# EAGLE design IO Shield_With_Power_Supply_PCB (EAGLE 6.4)
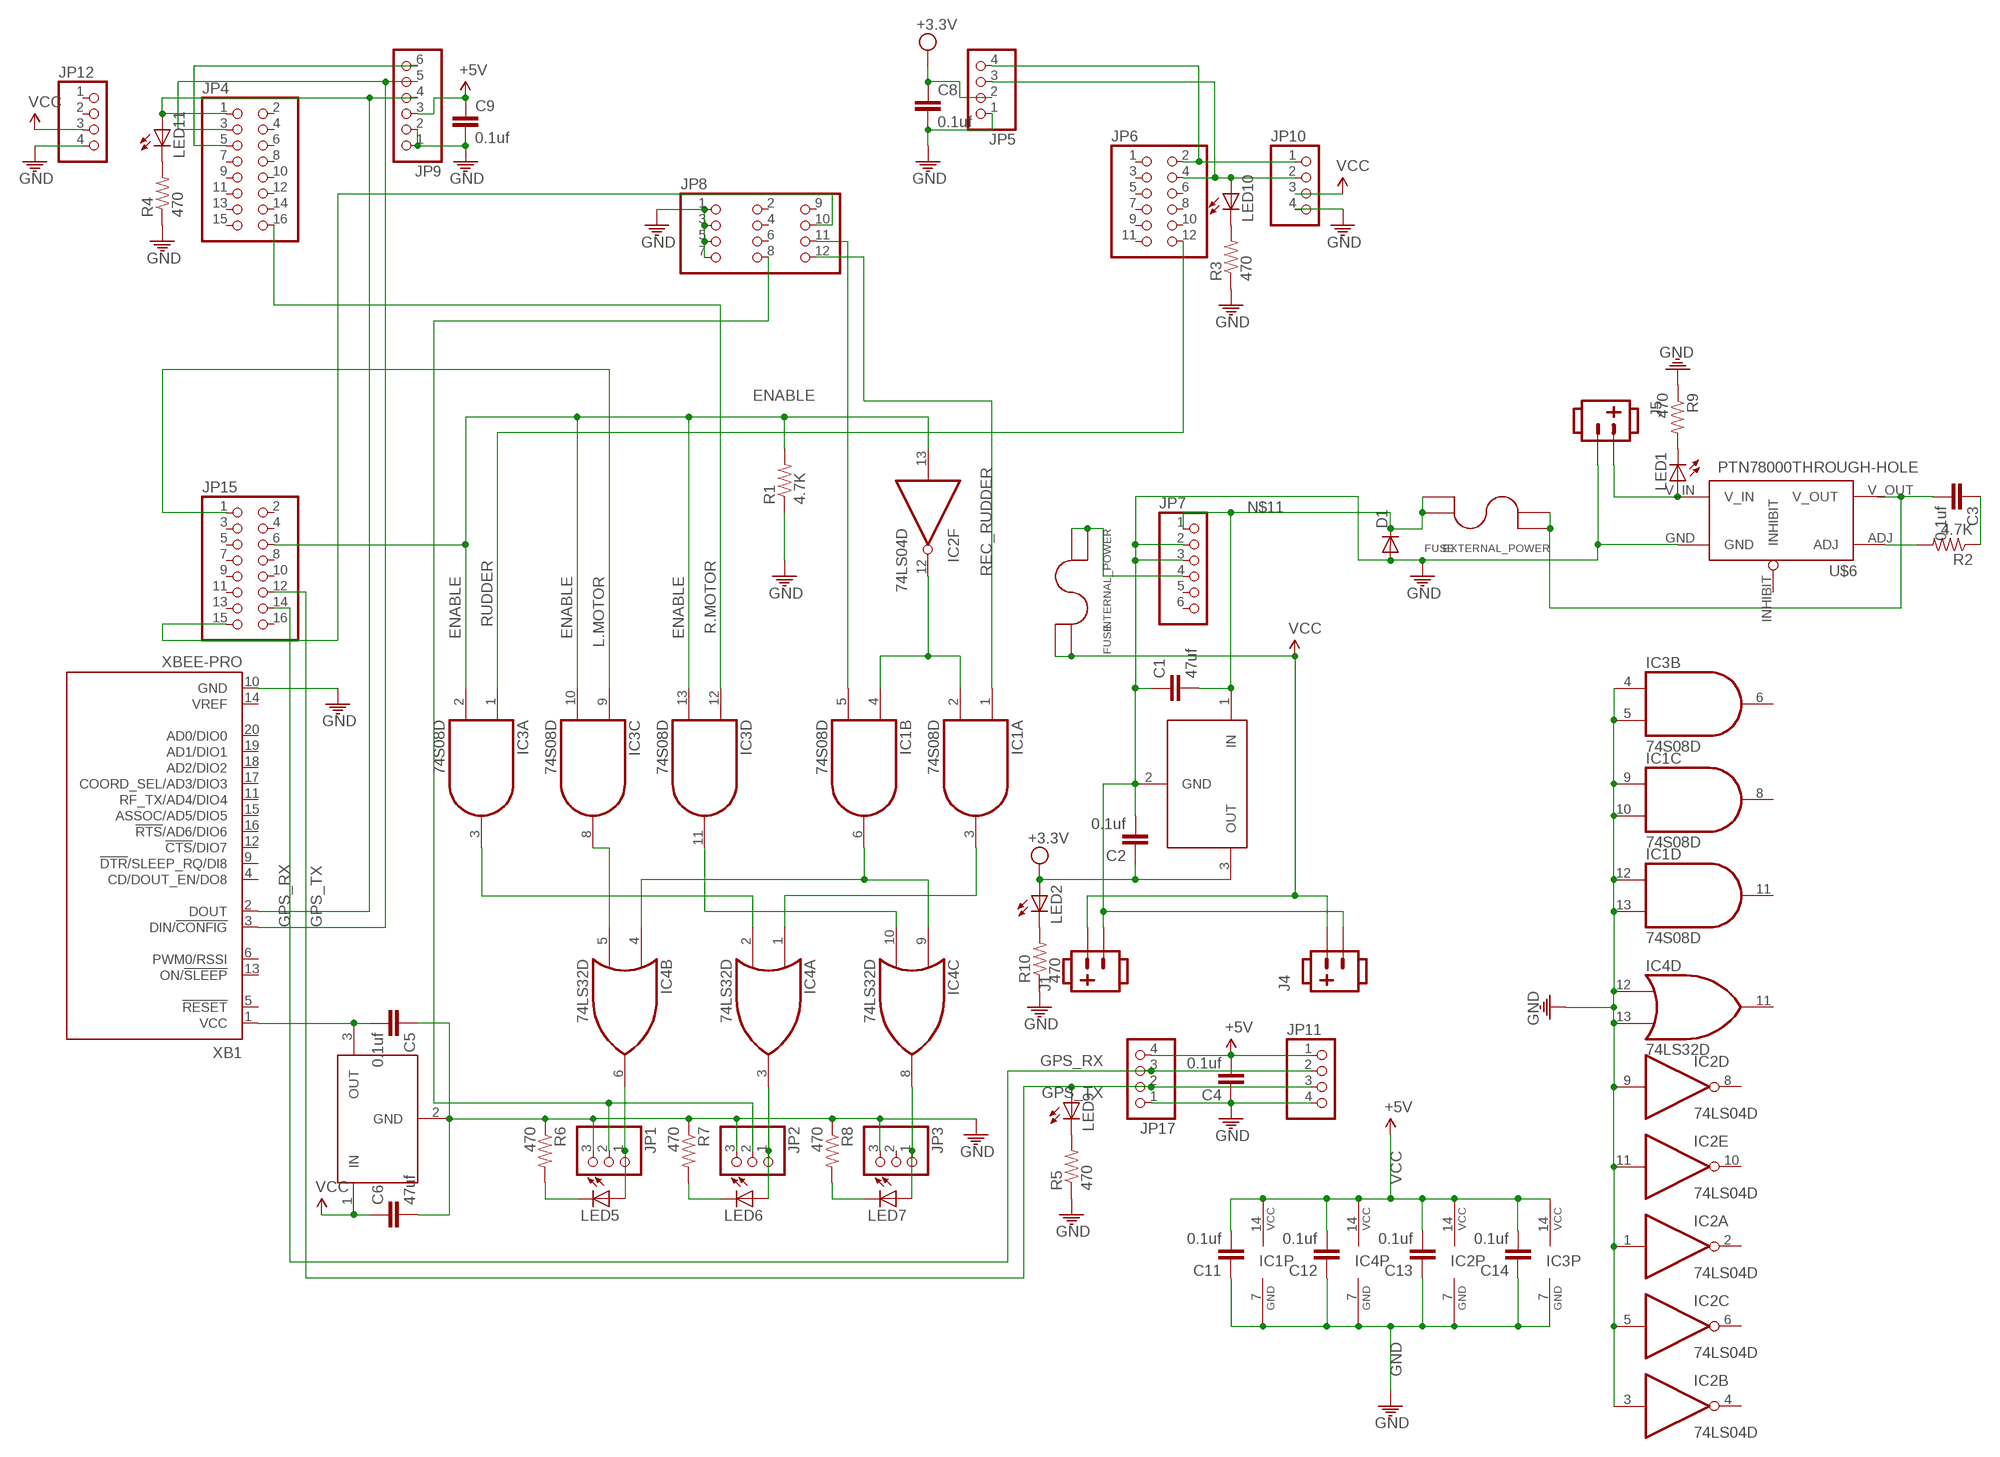
[diagram p0: schematic, sheet 1]

## Parts
C1  47uf  C-EUC0805  [C0805]
C2  0.1uf  C-EUC0805  [C0805]
C3  0.1uf  C-EUC0805  [C0805]
C4  0.1uf  C-EUC0805  [C0805]
C5  0.1uf  C-EUC0805  [C0805]
C6  47uf  C-EUC0805  [C0805]
C8  0.1uf  C-EUC0805  [C0805]
C9  0.1uf  C-EUC0805  [C0805]
C11  0.1uf  C-EUC0805  [C0805]
C12  0.1uf  C-EUC0805  [C0805]
C13  0.1uf  C-EUC0805  [C0805]
C14  0.1uf  C-EUC0805  [C0805]
D1  DIODEPTH  [DIODE-1N4001]
EXTERNAL_POWER  FUSE  [FUSE_2AG]
IC1  74S08D  [SO14]
IC2  74LS04D  [SO14]
IC3  74S08D  [SO14]
IC4  74LS32D  [SO14]
INTERNAL_POWER  FUSE  [FUSE_2AG]
J1  POW_CONNECTFEMALE-RA  [SOCKET-FEMALE_RA-3.96MM-2]
J4  POW_CONNECTFEMALE-RA  [SOCKET-FEMALE_RA-3.96MM-2]
J5  POW_CONNECTFEMALE-RA  [SOCKET-FEMALE_RA-3.96MM-2]
JP1  PINHD-1X3/90  [1X03/90]
JP2  PINHD-1X3/90  [1X03/90]
JP3  PINHD-1X3/90  [1X03/90]
JP4  PINHD-2X8  [2X08]
JP5  PINHD-1X4  [1X04]
JP6  PINHD-2X6  [2X06]
JP7  PINHD-1X6  [1X06]
JP8  PINHD-2X4  [2X04]
JP9  PINHD-1X6  [1X06]
JP10  PINHD-1X4/90  [1X04/90]
JP11  PINHD-1X4/90  [1X04/90]
JP12  PINHD-1X4/90  [1X04/90]
JP15  PINHD-2X8  [2X08]
JP17  PINHD-1X4  [1X04]
LED1  LED-FKIT-1206  [FKIT-LED-1206]
LED2  LED-FKIT-1206  [FKIT-LED-1206]
LED5  LED-FKIT-1206  [FKIT-LED-1206]
LED6  LED-FKIT-1206  [FKIT-LED-1206]
LED7  LED-FKIT-1206  [FKIT-LED-1206]
LED9  LED-FKIT-1206  [FKIT-LED-1206]
LED10  LED-FKIT-1206  [FKIT-LED-1206]
LED11  LED-FKIT-1206  [FKIT-LED-1206]
R1  4.7K  RESISTOR0805-RES  [0805]
R2  4.7K  RESISTOR0805-RES  [0805]
R3  470  RESISTOR0805-RES  [0805]
R4  470  RESISTOR0805-RES  [0805]
R5  470  RESISTOR0805-RES  [0805]
R6  470  RESISTOR0805-RES  [0805]
R7  470  RESISTOR0805-RES  [0805]
R8  470  RESISTOR0805-RES  [0805]
R9  470  RESISTOR0805-RES  [0805]
R10  470  RESISTOR0805-RES  [0805]
U$1  LM3940IMP-3.3  [SOT223]
U$6  PTN78000THROUGH-HOLE  [PTN78000]
U$7  LM3940IMP-3.3  [SOT223]
XB1  XBEE-PRO  [XBEE-PRO]

## Nets
ENABLE: IC2.13(F:I) IC3.2(A:I1) IC3.10(C:I1) IC3.13(D:I1) JP15.6 R1.2
GND: C1.1 C2.2 C4.1 C5.1 C6.2 C8.2 C9.2 C11.1 C12.1 C13.1 C14.1 D1.A IC1.7(P:GND) IC1.9(C:I0) IC1.10(C:I1) IC1.12(D:I0) IC1.13(D:I1) IC2.1(A:I) IC2.3(B:I) IC2.5(C:I) IC2.7(P:GND) IC2.9(D:I) IC2.11(E:I) IC3.4(B:I0) IC3.5(B:I1) IC3.7(P:GND) IC4.7(P:GND) IC4.12(D:I0) IC4.13(D:I1) J1.2 J4.2 J5.2 JP1.3 JP2.3 JP3.3 JP5.1 JP7.2 JP7.3 JP8.1 JP8.3 JP8.5 JP8.7 JP9.1 JP9.2 JP10.4 JP11.4 JP12.4 JP17.1 R1.1 R3.1 R4.1 R5.1 R6.1 R7.1 R8.1 R9.1 R10.1 U$1.2(GND) U$6.GND U$7.2(GND) XB1.10(GND)
GPS_RX: JP11.2 JP15.14 JP17.3
GPS_TX: JP11.3 JP15.12 JP17.2 LED9.A
L.MOTOR: IC3.9(C:I0) JP15.1
N$1: IC1.3(A:O) IC4.1(A:I0)
N$2: IC1.6(B:O) IC4.4(B:I0) IC4.9(C:I0)
N$3: IC1.2(A:I1) IC1.4(B:I0) IC2.12(F:O)
N$4: JP4.1 JP9.4 LED11.A XB1.2(DOUT)
N$5: IC3.11(D:O) IC4.10(C:I1)
N$6: IC3.8(C:O) IC4.5(B:I1)
N$8: IC4.6(B:O) JP1.1 LED5.A
N$9: IC4.3(A:O) JP2.1 LED6.A
N$10: IC4.8(C:O) JP3.1 LED7.A
N$11: C1.2 D1.C EXTERNAL_POWER.P$3 EXTERNAL_POWER.P$4 JP7.1 U$1.1(IN)
N$12: JP1.2 JP2.2 JP8.8
N$13: C3.2 EXTERNAL_POWER.P$1 EXTERNAL_POWER.P$2 U$6.V_OUT
N$14: JP8.10 JP15.15
N$15: C5.2 U$7.3(OUT) XB1.1(VCC)
N$16: J5.1 LED1.A U$6.V_IN
N$17: JP4.3 JP9.5 XB1.3(DIN/!CONFIG)
N$18: JP4.5 JP9.6
N$19: LED10.C R3.2
N$20: LED11.C R4.2
N$21: LED9.C R5.2
N$22: LED5.C R6.2
N$23: LED6.C R7.2
N$24: LED7.C R8.2
N$25: LED1.C R9.2
N$26: LED2.C R10.2
N$27: IC3.3(A:O) IC4.2(A:I1)
N$35: R2.2 U$6.ADJ
N$43: C3.1 R2.1
N$44: INTERNAL_POWER.P$1 INTERNAL_POWER.P$2 JP7.4
N$49: JP5.4 JP6.2 JP10.1
N$50: JP5.3 JP6.4 JP10.2 LED10.A
R.MOTOR: IC3.12(D:I0) JP4.16
REC.MOTOR: IC1.5(B:I1) JP8.11
REC_RUDDER: IC1.1(A:I0) JP8.12
RUDDER: IC3.1(A:I0) JP6.12
VCC: C4.2 C6.1 C9.1 C11.2 C12.2 C13.2 C14.2 IC1.14(P:VCC) IC2.14(P:VCC) IC3.14(P:VCC) IC4.14(P:VCC) INTERNAL_POWER.P$3 INTERNAL_POWER.P$4 J1.1 J4.1 JP9.3 JP10.3 JP11.1 JP12.3 JP17.4 U$7.1(IN) ; supply symbol labelled +5V
VDD: C2.1 C8.1 JP5.2 LED2.A U$1.3(OUT) ; supply symbol labelled +3.3V
Unconnected: IC1.8(C:O) IC1.11(D:O) IC2.2(A:O) IC2.4(B:O) IC2.6(C:O) IC2.8(D:O) IC2.10(E:O) IC3.6(B:O) IC4.11(D:O) JP3.2 JP4.2 JP4.4 JP4.6 JP4.7 JP4.8 JP4.9 JP4.10 JP4.11 JP4.12 JP4.13 JP4.14 JP4.15 JP6.1 JP6.3 JP6.5 JP6.6 JP6.7 JP6.8 JP6.9 JP6.10 JP6.11 JP7.5 JP7.6 JP8.2 JP8.4 JP8.6 JP8.9 JP12.1 JP12.2 JP15.2 JP15.3 JP15.4 JP15.5 JP15.7 JP15.8 JP15.9 JP15.10 JP15.11 JP15.13 JP15.16 U$6.INHIBIT XB1.4(CD/DOUT_EN/DO8) XB1.5(!RESET) XB1.6(PWM0/RSSI) XB1.9(!DTR!/SLEEP_RQ/DI8) XB1.11(RF_TX/AD4/DIO4) XB1.12(!CTS!/DIO7) XB1.13(ON/!SLEEP) XB1.14(VREF) XB1.15(ASSOC/AD5/DIO5) XB1.16(!RTS!/AD6/DIO6) XB1.17(COORD_SEL/AD3/DIO3) XB1.18(AD2/DIO2) XB1.19(AD1/DIO1) XB1.20(AD0/DIO0)

## Library data of the parts
C1-C6 C8 C9 C11-C14 = resistor:C-EU: CAPACITOR, European symbol
D1 = ASL:DIODE: Diode These are standard reverse protection diodes and small signal diodes. SMA package can handle up to about 1A. SOD-323 can handle about 200mA. What the SOD-323 package when ordering, there are some mfgs out there that are 5-pin packages.
EXTERNAL_POWER INTERNAL_POWER = ASL:FUSE
IC1 IC3 = 74xx-us:74*08: Quad 2-input AND gate
IC2 = 74xx-us:74*04: Hex INVERTER
IC4 = 74xx-us:74*32: Quad 2-input OR gate
J1 J4 J5 = ASL:POW_CONNECT
JP1-JP3 = pinhead:PINHD-1X3: PIN HEADER
JP4 JP15 = pinhead:PINHD-2X8: PIN HEADER
JP5 = SDLogger:PINHD-1X4: PIN HEADER
JP6 = pinhead:PINHD-2X6: PIN HEADER
JP7 = pinhead:PINHD-1X6: PIN HEADER
JP8 = pinhead:PINHD-2X4: PIN HEADER
JP9 = SDLogger:PINHD-1X6: PIN HEADER
JP10-JP12 JP17 = pinhead:PINHD-1X4: PIN HEADER
LED1 LED2 LED5-LED7 LED9-LED11 = ASL:LED: LEDs Standard schematic elements and footprints for 5mm, 3mm, 1206, and 0603 sized LEDs. 5mm - Spark Fun Electronics SKU : COM-00529 (and others)
R1-R10 = ASL:RESISTOR: Resistor Basic schematic elements and footprints for 0603, 1206, and PTH resistors.
U$1 U$7 = LM3940:LM3940IMP-3.3: 1A Low Dropout Regulator for 5V to 3.3V Conversion
U$6 = ASL:PTN78000: This is the PTN78000 part by Texas Instruments. It's a 1.5A adjustable switching regulator.
XB1 = maxstream:XBEE: XBee (TM) /XBee-PRO(TM) OEM RF Modules Source: MaxStream, Inc. xbee_productmanual.pdf; MPN: XBP24-AWI-001; OC_FARNELL: 1337916; OC_NEWARK: 42M2667

## Board
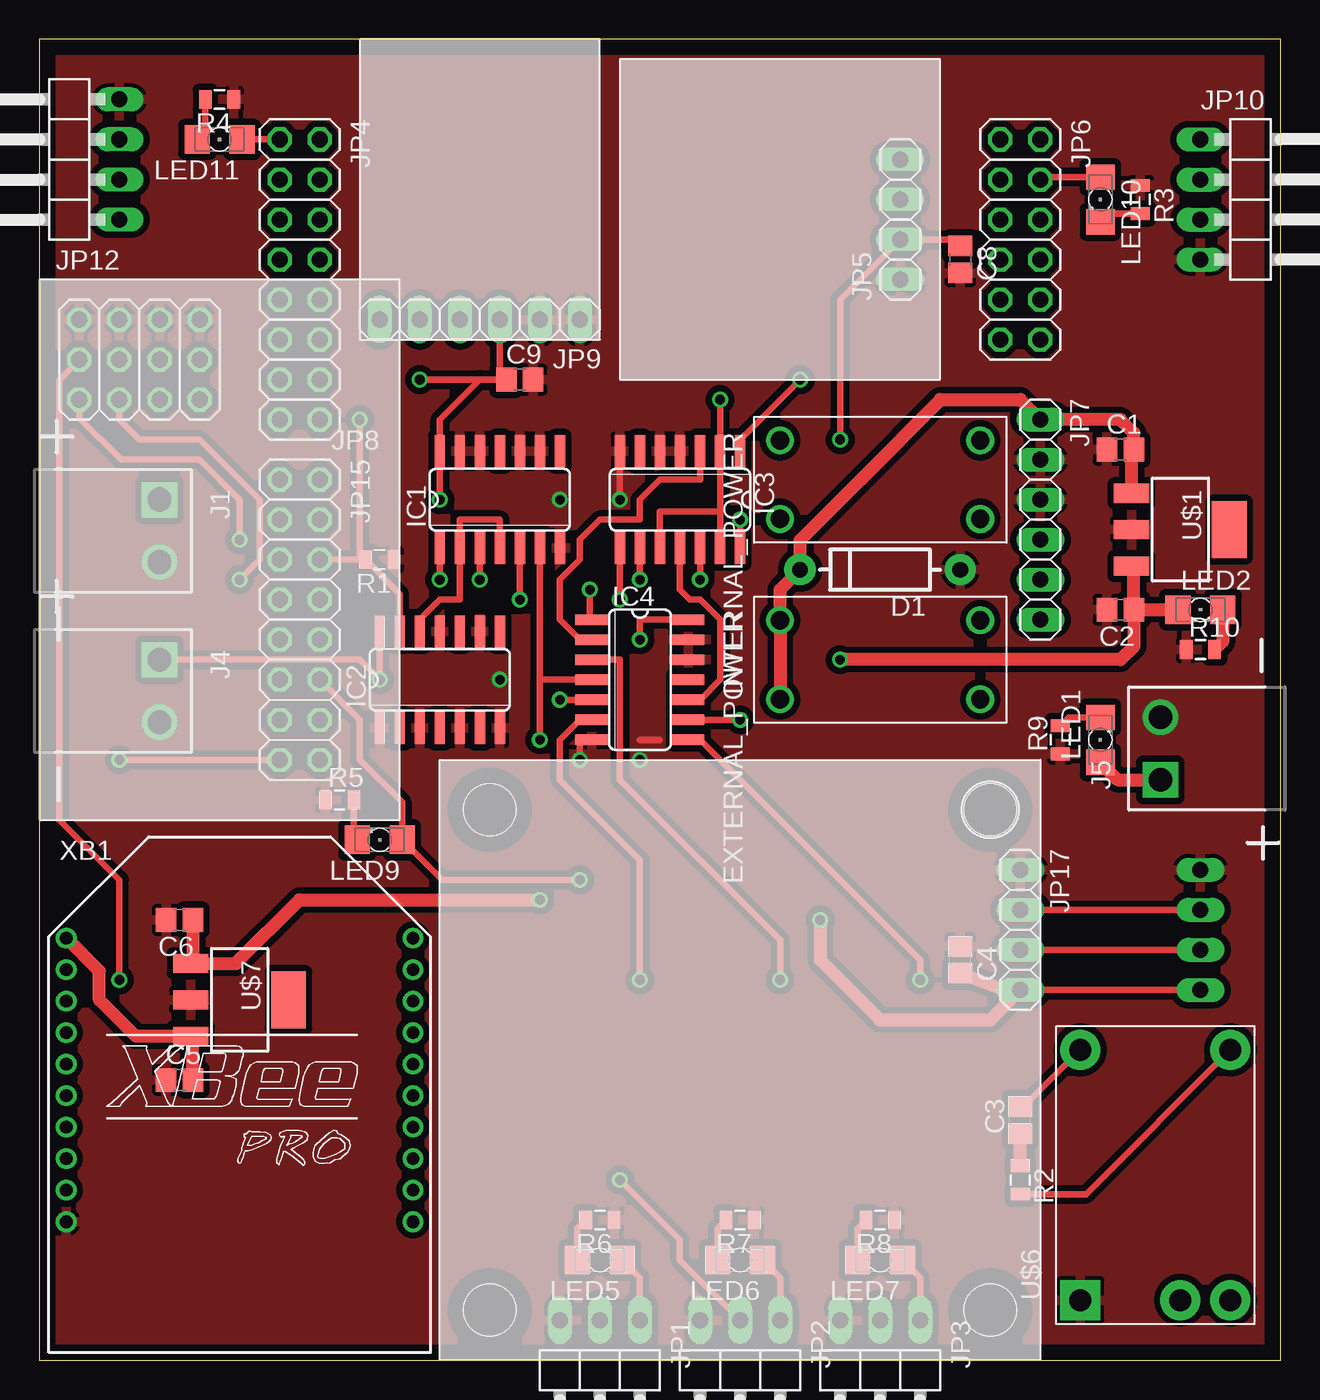
[diagram p1: board, top side]
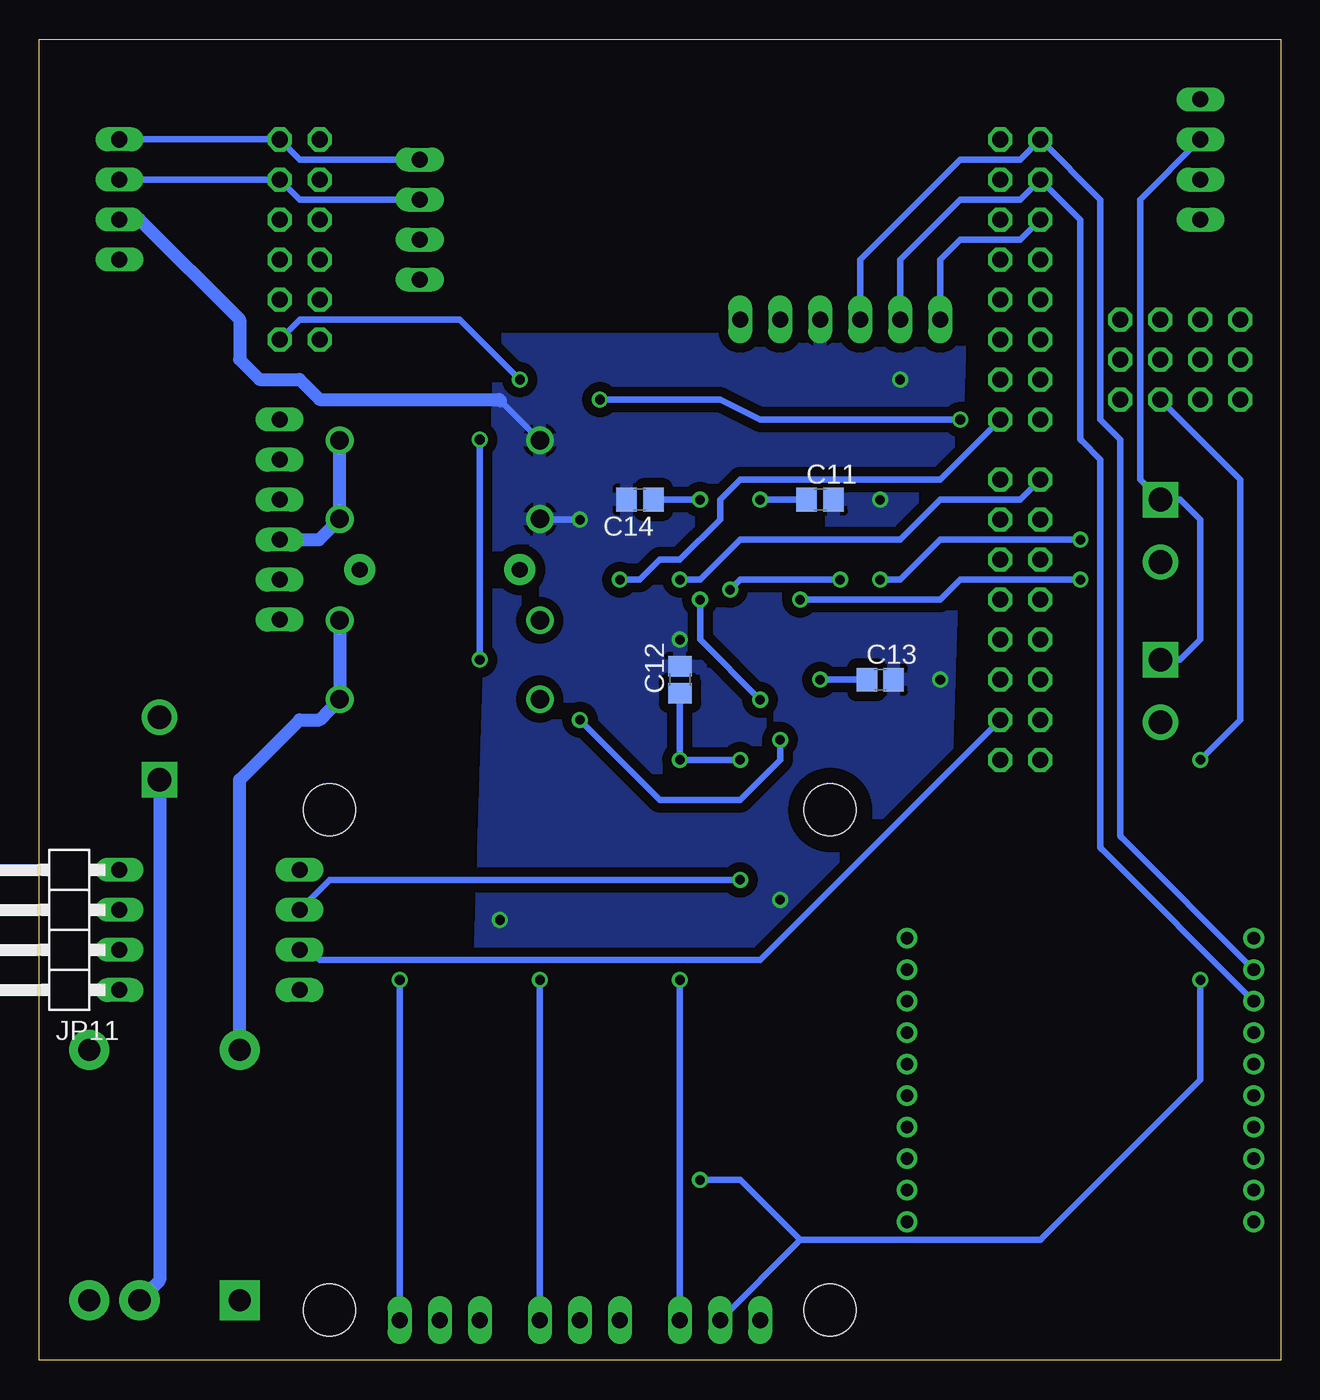
[diagram p2: board, bottom side, seen from below]

Size 78.74 x 83.82 mm. Coordinates in mm from the lower left corner, seen from the top.
Outline: 0,0 78.74,0 78.74,83.82 0,83.82 0,0
Copper layers (1*16): Top 0.035mm / dielectric 1.5mm / Bottom 0.035mm
Design rules "default": minimum track width 10mil, minimum drill 24mil, track to track 8mil, track to pad 8mil, pad to pad 8mil, via to via 8mil, smd to smd 8mil, copper to edge 40mil, drill to drill 8mil, minimum pad ring 10mil, minimum via ring 8mil, stop-mask expansion 4mil, vias tented up to drill 0mil, thermal gap 10mil
tRestrict: area 27.4,47.8 to 29.7,48.8

### Footprints (pad centres in the part's own frame; a part is rotated, then mirrored left to right if it is on the bottom)
C0805 = smd 1.3 x 1.5: 1 -0.85,0; 2 0.85,0
DIODE-1N4001 = drill 1 pad 1.981: A -5.08,0; C 5.08,0
FUSE_2AG = drill 1.17: P$1 -2.5,6.35; P$2 2.5,6.35; P$3 -2.5,-6.35; P$4 2.5,-6.35
SO14 = smd 0.66 x 2.032: 1 -3.81,-3.073; 2 -2.54,-3.073; 3 -1.27,-3.073; 4 0,-3.073; 5 1.27,-3.073; 6 2.54,-3.073; 7 3.81,-3.073; 8 3.81,3.073; 9 2.54,3.073; 10 1.27,3.073; 11 0,3.073; 12 -1.27,3.073; 13 -2.54,3.073; 14 -3.81,3.073
SOCKET-FEMALE_RA-3.96MM-2 = drill 1.5 square: 1 0,0 | drill 1.5: 2 3.96,0
1X03/90 = drill 1.016 long: 1 -2.54,-3.81; 2 0,-3.81; 3 2.54,-3.81
2X08 = drill 1.016 octagon: 1 -8.89,-1.27; 2 -8.89,1.27; 3 -6.35,-1.27; 4 -6.35,1.27; 5 -3.81,-1.27; 6 -3.81,1.27; 7 -1.27,-1.27; 8 -1.27,1.27; 9 1.27,-1.27; 10 1.27,1.27; 11 3.81,-1.27; 12 3.81,1.27; 13 6.35,-1.27; 14 6.35,1.27; 15 8.89,-1.27; 16 8.89,1.27
1X04 = drill 1.016 long: 1 -3.81,0; 2 -1.27,0; 3 1.27,0; 4 3.81,0
2X06 = drill 1.016 octagon: 1 -6.35,-1.27; 2 -6.35,1.27; 3 -3.81,-1.27; 4 -3.81,1.27; 5 -1.27,-1.27; 6 -1.27,1.27; 7 1.27,-1.27; 8 1.27,1.27; 9 3.81,-1.27; 10 3.81,1.27; 11 6.35,-1.27; 12 6.35,1.27
1X06 = drill 1.016 long: 1 -6.35,0; 2 -3.81,0; 3 -1.27,0; 4 1.27,0; 5 3.81,0; 6 6.35,0
2X04 = drill 1.016 octagon: 1 6.35,-1.27; 2 6.35,1.27; 3 8.89,-1.27; 4 8.89,1.27; 5 11.43,-1.27; 6 11.43,1.27; 7 13.97,-1.27; 8 13.97,1.27; 9 6.35,3.81; 10 8.89,3.81; 11 11.43,3.81; 12 13.97,3.81
1X04/90 = drill 1.016 long: 1 -3.81,-3.81; 2 -1.27,-3.81; 3 1.27,-3.81; 4 3.81,-3.81
1X04' = drill 1.016 long: 1 -3.175,0; 2 -0.635,0; 3 1.905,0; 4 4.445,0
FKIT-LED-1206 = smd 1.6 x 1.803: A -1.422,0; C 1.422,0
0805 = smd 0.8 x 1.2: 1 -0.9,0; 2 0.9,0
SOT223 = smd 1.219 x 2.235: 1 -2.311,-3.099; 2 0,-3.099; 3 2.311,-3.099 | smd 3.6 x 2.2: 4 0,3.099
STAND-OFF = hole 3.302: 0,0
PTN78000 = drill 1.397 pad 2.54: ADJ 15.875,-9.525; INHIBIT 0,-9.525; V_IN 0,-6.35; V_OUT 15.875,0 | drill 1.397 pad 2.54 square: GND 0,0
XBEE-PRO = drill 0.8 pad 1.27: 1 -11,9; 2 -11,7; 3 -11,5; 4 -11,3; 5 -11,1; 6 -11,-1; 7 -11,-3; 8 -11,-5; 9 -11,-7; 10 -11,-9; 11 11,-9; 12 11,-7; 13 11,-5; 14 11,-3; 15 11,-1; 16 11,1; 17 11,3; 18 11,5; 19 11,7; 20 11,9

### Placement (x,y rotation side)
C1  68.58,57.79 0 top
C2  68.58,47.62 180 top
C3  62.23,15.24 90 top
C4  58.42,25.4 270 top
C5  8.89,17.78 0 top
C6  8.89,27.94 180 top
C8  58.42,69.85 270 top
C9  30.48,62.23 0 top
C11  29.21,54.61 0 bottom
C12  38.1,43.18 90 bottom
C13  25.4,43.18 0 bottom
C14  40.64,54.61 180 bottom
D1  53.34,50.17 180 top
EXTERNAL_POWER  53.34,44.45 270 top
IC1  29.21,54.61 0 top
IC2  25.4,43.18 0 top
IC3  40.64,54.61 180 top
IC4  38.1,43.18 270 top
INTERNAL_POWER  53.34,55.88 270 top
J1  7.62,54.61 270 top
J4  7.62,44.45 270 top
J5  71.12,36.83 90 top
JP1  35.56,-1.27 180 top
JP2  44.45,-1.27 180 top
JP3  53.34,-1.27 180 top
JP4  16.51,68.58 270 top
JP5  54.61,72.39 90 top
JP6  62.23,71.12 270 top
JP7  63.5,53.34 270 top
JP8  16.51,64.77 180 top
JP9  27.94,66.04 180 top
JP10  77.47,73.66 270 top
JP11  77.47,27.3 90 bottom
JP12  1.27,76.2 90 top
JP15  16.51,46.99 270 top
JP17  [1X04']  62.23,27.94 270 top
LED1  67.31,39.37 90 top
LED2  73.66,47.62 0 top
LED5  35.56,6.35 180 top
LED6  44.45,6.35 180 top
LED7  53.34,6.35 180 top
LED9  21.59,33.02 180 top
LED10  67.31,73.66 270 top
LED11  11.43,77.47 180 top
R1  21.59,50.8 180 top
R2  62.23,11.43 270 top
R3  69.85,73.66 270 top
R4  11.43,80.01 180 top
R5  19.05,35.56 0 top
R6  35.56,8.89 180 top
R7  44.45,8.89 180 top
R8  53.34,8.89 180 top
R9  64.77,39.37 90 top
R10  73.66,45.09 0 top
U$1  72.39,52.71 270 top
U$2  [STAND-OFF]  60.33,3.17 0 top
U$3  [STAND-OFF]  28.57,3.17 0 top
U$4  [STAND-OFF]  28.57,34.93 0 top
U$5  [STAND-OFF]  60.33,34.93 0 top
U$6  66.04,3.81 90 top
U$7  12.7,22.86 270 top
XB1  12.7,17.78 0 top

### Tracks (layer width: path | path; a pad name or v marks a point on that pad's centre or on a via)
ENABLE  (via drill 0.61)
  Top 0.406: 43.18,53.85 IC3.13 | IC3.10 39.37,53.85 43.18,53.85 | v43.18,60.96 IC3.2 43.18,53.85 | JP15.6 R1.2 | IC2.13 22.86,48.63 R1.2 | R1.2 20.32,50.8 v20.32,59.69
  Bottom 0.406: v20.32,59.69 33.02,59.69 35.56,60.96 v43.18,60.96
GND  (via drill 0.61)
  Top 0.406: 38.1,39.37 39.37,39.37 | IC4.7 34.29,39.37 v34.29,38.1 | v36.83,54.61 IC3.7
  Bottom 0.406: v34.29,38.1 v38.1,38.1 C12.1 | C11.1 v33.02,54.61 | C13.1 v29.21,43.18 | C14.1 v36.83,54.61
  pour Top (isolate 0.406): 78.74,0 0,0 0,83.82 78.74,83.82
GPS_RX
  Top 0.406: JP17.3 JP11.2
  Bottom 0.406: JP15.14 33.02,25.4 60.96,25.4 61.59,26.04 JP17.3
GPS_TX  (via drill 0.61)
  Top 0.406: JP15.12 20.32,40.64 20.32,38.1 23.01,35.41 LED9.A 25.55,30.48 v34.29,30.48 | JP17.2 JP11.3
  Bottom 0.406: v34.29,30.48 60.33,30.48 JP17.2
L.MOTOR  (via drill 0.61)
  Top 0.406: v38.1,49.53 IC3.9
  Bottom 0.406: JP15.1 16.51,54.61 21.59,54.61 24.13,52.07 34.29,52.07 36.83,49.53 v38.1,49.53
N$1  (via drill 0.61)
  Top 0.406: 27.94,50.8 IC1.3 v27.94,49.53 | IC4.1 34.92,46.99 v34.92,48.9
  Bottom 0.406: v34.92,48.9 34.29,49.53 v27.94,49.53
N$2  (via drill 0.61)
  Top 0.406: IC1.6 31.75,43.18 | 31.75,43.18 IC4.4 | v31.75,39.37 31.75,43.18 | v44.45,40.64 IC4.9
  Bottom 0.406: v44.45,40.64 39.37,35.56 34.29,35.56 31.75,38.1 v31.75,39.37
N$3
  Top 0.406: 29.21,50.8 IC1.4 29.21,53.34 26.67,53.34 IC1.2 26.67,48.26 25.4,48.26 24.13,46.99 IC2.12
N$4
  Top 0.406: LED11.A JP4.1
  Bottom 0.406: JP9.4 26.67,69.85 20.32,76.2 16.51,76.2 JP4.1 11.43,73.66 11.43,59.69 10.16,58.42 10.16,33.35 arc-45 10.09,33.17 XB1.2
N$5
  Top 0.406: IC4.10 41.91,41.91 43.18,43.18 43.18,46.99 41.91,48.26 41.27,48.26 40.64,48.9 IC3.11
N$6  (via drill 0.61)
  Top 0.406: IC3.8 v36.83,48.26 | v33.02,41.91 IC4.5
  Bottom 0.406: v36.83,48.26 36.83,45.72 v33.02,41.91
N$8  (via drill 0.61)
  Top 0.406: IC4.6 34.29,40.64 33.02,39.37 33.02,36.83 38.1,31.75 v38.1,24.13 | JP1.1 38.1,5.23 LED5.A
  Bottom 0.406: v38.1,24.13 JP1.1
N$9  (via drill 0.61)
  Top 0.406: IC4.3 36.83,44.45 36.83,36.83 46.99,26.67 v46.99,24.13 | JP2.1 46.99,5.23 LED6.A
  Bottom 0.406: v46.99,24.13 JP2.1
N$10  (via drill 0.61)
  Top 0.406: IC4.8 41.91,39.37 55.88,25.4 v55.88,24.13 | JP3.1 55.88,5.23 LED7.A
  Bottom 0.406: v55.88,24.13 JP3.1
N$11
  Top 0.813: EXTERNAL_POWER.P$4 EXTERNAL_POWER.P$3 46.99,48.9 D1.C 48.26,52.03 52.11,55.88 57.15,60.96 62.23,60.96 JP7.1 68.58,59.69 69.43,58.84 C1.2 69.29,57.65 U$1.1
N$12  (via drill 0.61)
  Top 0.406: JP8.8 1.34,62.3 arc45 1.27,62.12 1.27,34.29 5.08,30.48 v5.08,24.13 | JP2.2 40.64,6.35 40.64,7.62 v36.83,11.43
  Bottom 0.406: 30.48,7.62 15.35,7.62 arc-45 15.17,7.69 5.08,17.78 v5.08,24.13 | 30.48,7.62 JP1.2 | v36.83,11.43 34.29,11.43 30.48,7.62
N$13
  Top 0.406: C3.2 62.44,16.09 U$6.V_OUT
  Bottom 0.813: EXTERNAL_POWER.P$1 EXTERNAL_POWER.P$2 60.96,40.64 62.23,40.64 66.04,36.83 U$6.V_OUT
N$14  (via drill 0.61)
  Top 0.406: JP15.15 5.18,38.1 arc-45 5.01,38.17 v5.08,38.1
  Bottom 0.406: JP8.10 2.54,55.88 2.54,40.64 v5.08,38.1
N$15
  Top 0.406: 9.74,20.41 U$7.3
  Top 0.813: U$7.3 6.12,20.55 3.81,22.86 3.81,24.67 XB1.1 | C5.2 9.74,20.41
N$16
  Top 0.813: LED1.A 68.43,36.83 J5.1
  Bottom 0.813: J5.1 71.12,5.08 U$6.V_IN
N$17
  Bottom 0.406: JP9.5 24.13,69.85 20.32,73.66 16.51,73.66 JP4.3 12.7,72.39 12.7,58.53 arc-45 12.63,58.35 11.43,57.15 11.43,32.62 arc-45 11.36,32.44 XB1.3
N$18
  Bottom 0.406: JP4.5 16.51,71.12 20.32,71.12 21.59,69.85 JP9.6
N$19
  Top 0.406: LED10.C 67.83,72.76 R3.2
N$20
  Top 0.406: R4.2 10.53,77.99 LED11.C
N$21
  Top 0.406: R5.2 19.95,33.24 LED9.C
N$22
  Top 0.406: LED5.C 34.14,8.37 R6.2
N$23
  Top 0.406: LED6.C 43.03,8.37 R7.2
N$24
  Top 0.406: LED7.C 51.92,8.37 R8.2
N$25
  Top 0.406: LED1.C 65.29,40.79 R9.2
N$26
  Top 0.813: LED2.C 75.08,45.61 R10.2
N$27
  Top 0.406: IC3.3 41.91,55.88 39.37,55.88 38.1,54.61 38.1,53.34 35.56,53.34 34.29,52.07 34.29,50.8 33.02,49.53 33.02,46.99 34.29,45.72 IC4.2
N$35
  Top 0.406: R2.2 66.41,10.53 U$6.ADJ
N$43
  Top 0.813: R2.1 C3.1
N$44
  Bottom 0.813: JP7.4 61,52.07 INTERNAL_POWER.P$2 INTERNAL_POWER.P$1
N$49
  Bottom 0.406: JP5.4 62.23,76.2 JP6.2 JP10.1
N$50
  Top 0.406: LED10.A 63.65,75.08 JP6.4
  Bottom 0.406: JP5.3 62.23,73.66 JP6.4 JP10.2
R.MOTOR  (via drill 0.61)
  Top 0.406: v41.91,49.53 IC3.12
  Bottom 0.406: JP4.16 21.59,55.88 34.29,55.88 35.56,54.61 35.56,53.34 38.1,50.8 39.37,50.8 40.64,49.53 v41.91,49.53
REC.MOTOR  (via drill 0.61)
  Top 0.406: IC1.5 v30.48,48.26 | v12.7,49.53 13.97,50.8 13.97,54.61 10.16,58.42 6.35,58.42 5.08,59.69 JP8.11
  Bottom 0.406: v30.48,48.26 21.59,48.26 20.32,49.53 v12.7,49.53
REC_RUDDER  (via drill 0.61)
  Top 0.406: v25.4,49.53 IC1.1 | JP8.12 2.54,59.8 5.18,57.15 10.16,57.15 12.63,54.68 arc-45 12.7,54.51 v12.7,52.07
  Bottom 0.406: v25.4,49.53 24.13,49.53 21.59,52.07 v12.7,52.07
RUDDER  (via drill 0.61)
  Top 0.406: v48.26,62.23 44.45,58.42 IC3.1
  Bottom 0.406: JP6.12 62.23,66.04 52.07,66.04 v48.26,62.23
VCC  (via drill 0.61)
  Top 0.406: IC2.14 v21.59,43.18 20.32,44.45 J4.1 | IC4.14 38.1,46.99 v38.1,45.72 | JP9.3 29.21,62.65 C9.1 27.94,62.23 | IC3.14 v44.45,53.34 | v25.4,54.61 IC1.14 25.4,59.69 27.94,62.23 | v24.13,62.23 27.94,62.23 | 9.74,25.31 U$7.1 | JP17.4 JP11.1
  Top 0.813: C6.1 9.74,25.31 | v31.75,29.21 16.51,29.21 12.47,25.17 U$7.1 | C4.2 61.17,23.5 JP17.4 60.33,21.59 53.34,21.59 49.53,25.4 v49.53,27.94
  Bottom 0.406: v44.45,53.34 46.95,53.34 INTERNAL_POWER.P$4 | INTERNAL_POWER.P$3 49.5,60.89 arc-45 49.67,60.96 | J4.1 6.35,44.45 5.08,45.72 5.08,53.34 6.35,54.61 J1.1 8.89,55.88 8.89,73.66 JP12.3
  Bottom 0.813: JP10.3 72.39,72.39 66.04,66.04 66.04,63.5 64.77,62.23 62.23,62.23 60.96,60.96 49.57,60.96 49.5,60.89
  pour Bottom (isolate 0.61): 49.53,64.77 50.8,25.4 21.59,25.4 20.32,64.77
VDD  (via drill 0.61)
  Top 0.406: C8.1 58,71.12 JP5.2 50.8,67.31 v50.8,58.42
  Top 0.813: C2.1 69.43,50.26 U$1.3 | C2.1 LED2.A | C2.1 69.43,45.3 68.58,44.45 v50.8,44.45
  Bottom 0.406: v50.8,44.45 v50.8,58.42